# Altium schematic sheet MSP430G2553.SchDoc: MSP430G2552 connections
size A4; DrawnBy: Mandus Börjesson; Revision: A
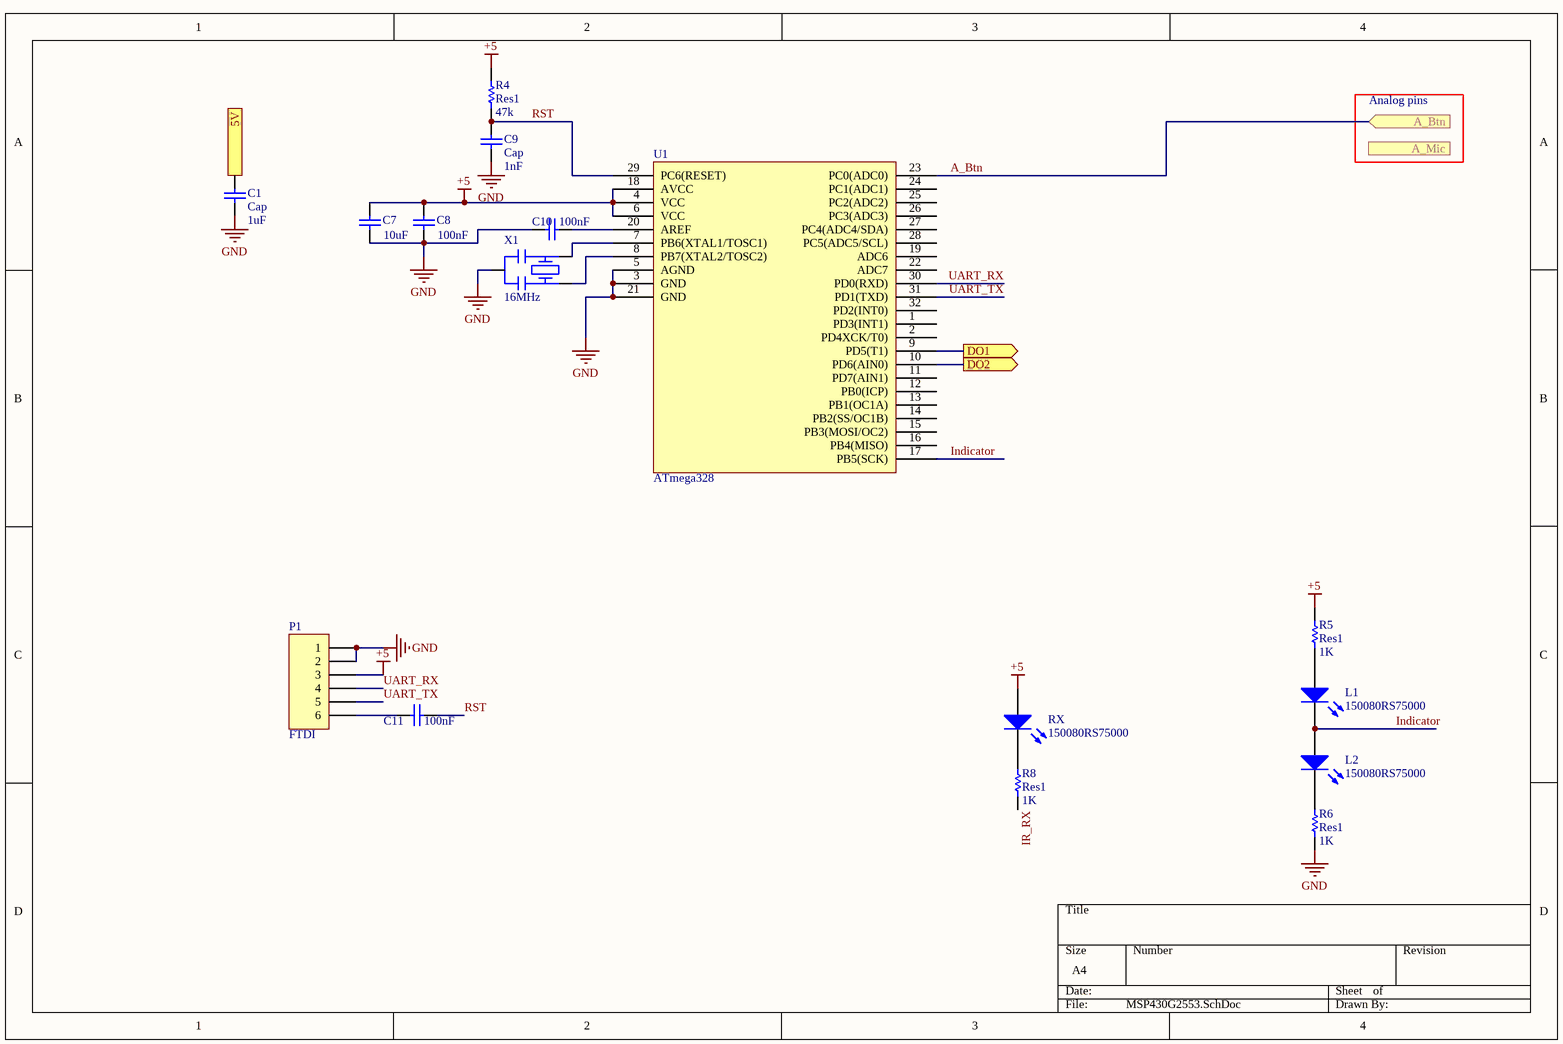
[diagram p0: MSP430G2553.SchDoc]

## Parts
C1  Cap  value 1uF  [6-0805_M]
C7  value 10uF  [6-0805_N]  (hidden comment: Cap)
C8  value 100nF  [6-0805_N]  (hidden comment: Cap)
C9  Cap  value 1nF  [6-0805_N]
C10  value 100nF  [6-0805_N]  (hidden comment: Cap)
C11  value 100nF  [6-0805_N]  (hidden comment: Cap)
L1  150080RS75000  [0805_A]
L2  150080RS75000  [0805_A]
P1  FTDI  [HDR1X6H]
R4  Res1  value 47k  [6-0805_N]
R5  Res1  value 1K  [6-0805_M]
R6  Res1  value 1K  [6-0805_M]
R8  Res1  value 1K  [6-0805_N]
RX  150080RS75000  [0805_A]
U1  ATmega328  [TQFP32]
X1  16MHz  [osc]

## Ports
5V (in), A_Btn (in), A_Mic (in), DO1 (out), DO2 (out)

## Nets
+5: C7.1 C8.1 P1.3 R4.2 R5.2 RX.2(A) U1.4(VCC) U1.6(VCC) U1.18(AVCC)
GND: C1.2 C7.2 C8.2 C9.1 C10.2 P1.1 P1.2 R6.1 U1.3(GND) U1.5(AGND) U1.21(GND) X1.GND
5V: C1.1 ; port 5V
A_Btn: U1.23(PC0(ADC0)) ; port A_Btn
DO1: U1.9(PD5(T1)) ; port DO1
DO2: U1.10(PD6(AIN0)) ; port DO2
Indicator: L1.1(K) L2.2(A) U1.17(PB5(SCK))
IR_RX: R8.1
RST: C9.2 C11.1 R4.1 U1.29(PC6(RESET))
UART_RX: P1.4 U1.30(PD0(RXD))
UART_TX: P1.5 U1.31(PD1(TXD))
NetC10_1: C10.1 U1.20(AREF)
NetC11_2: C11.2 P1.6
NetL1_2: L1.2(A) R5.1
NetL2_1: L2.1(K) R6.2
NetR8_2: R8.2 RX.1(K)
NetU1_7: U1.7(PB6(XTAL1/TOSC1)) X1.OSCO
NetU1_8: U1.8(PB7(XTAL2/TOSC2)) X1.OSCI

Not connected (* = marked no-connect by the designer): U1 1(PD3(INT1)) 2(PD4XCK/T0)) 11(PD7(AIN1)) 12(PB0(ICP)) 13(PB1(OC1A)) 14(PB2(SS/OC1B)) 15(PB3(MOSI/OC2)) 16(PB4(MISO)) 19(ADC6) 22(ADC7) 24(PC1(ADC1)) 25(PC2(ADC2)) 26(PC3(ADC3)) 27(PC4(ADC4/SDA)) 28(PC5(ADC5/SCL)) 32(PD2(INT0))

## Notes on the sheet
- Analog pins

## Library data of the parts
C1 C7-C11 = Cap: Capacitor; Published: 8-Jun-2000; LatestRevisionDate: 17-Jul-2002; LatestRevisionNote: Re-released for DXP Platform.; PackageReference: RAD-0.3; Publisher: Altium Limited; PackageDescription: Radial Cap, Thru-Hole; 2 Leads; 0.3 in Pin Spacing
L1 L2 RX = 150080RS75000: SMD mono-color Chip LED, WL-SMCW, Red; PackageReference: 0805_A; Color: Red; PartNumber: 150080RS75000; ComponentLink1Description: Manufacturer URL; ComponentLink1URL: http://www.we-online.com; ComponentLink2Description: Datasheet; ComponentLink2URL: http://katalog.we-online.com/led/datasheet/150080RS75000.pdf
P1 = Header 6H: Header, 6-Pin, Right Angle; LatestRevisionDate: 17-Jul-2002; LatestRevisionNote: Re-released for DXP Platform.; Publisher: Altium Limited
R4-R6 R8 = Res1: Resistor; Published: 8-Jun-2000; LatestRevisionDate: 17-Jul-2002; LatestRevisionNote: Re-released for DXP Platform.; PackageReference: AXIAL-0.3; Publisher: Altium Limited; PackageDescription: Axial Device, Thru-Hole; 2 Leads; 0.3 in Pin Spacing
X1 = xtal_1: CSTCE16M0V53-R0